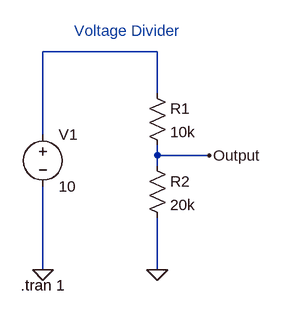
[diagram p0: schematic Draft4.asc]
Draft4.asc, the LTspice schematic file:
Version 4
SHEET 1 880 680
WIRE 192 32 16 32
WIRE 192 96 192 32
WIRE 16 160 16 32
WIRE 192 192 192 176
WIRE 272 192 192 192
WIRE 192 208 192 192
WIRE 16 368 16 240
WIRE 192 368 192 288
FLAG 16 368 0
FLAG 192 368 0
FLAG 272 192 Output
SYMBOL res 176 80 R0
SYMATTR InstName R1
SYMATTR Value 10k
SYMBOL res 176 192 R0
SYMATTR InstName R2
SYMATTR Value 20k
SYMBOL voltage 16 144 R0
WINDOW 123 0 0 Left 0
WINDOW 39 0 0 Left 0
SYMATTR InstName V1
SYMATTR Value 10
TEXT 64 0 Left 2 ;Voltage Divider
TEXT -18 392 Left 2 !.tran 1

The netlist it stands for:
* Draft4.asc
R1 N001 Output 10k
R2 Output 0 20k
V1 N001 0 10
* Voltage Divider
.tran 1
.backanno
.end